# EAGLE design 19260^0 (EAGLE 7.6.0)
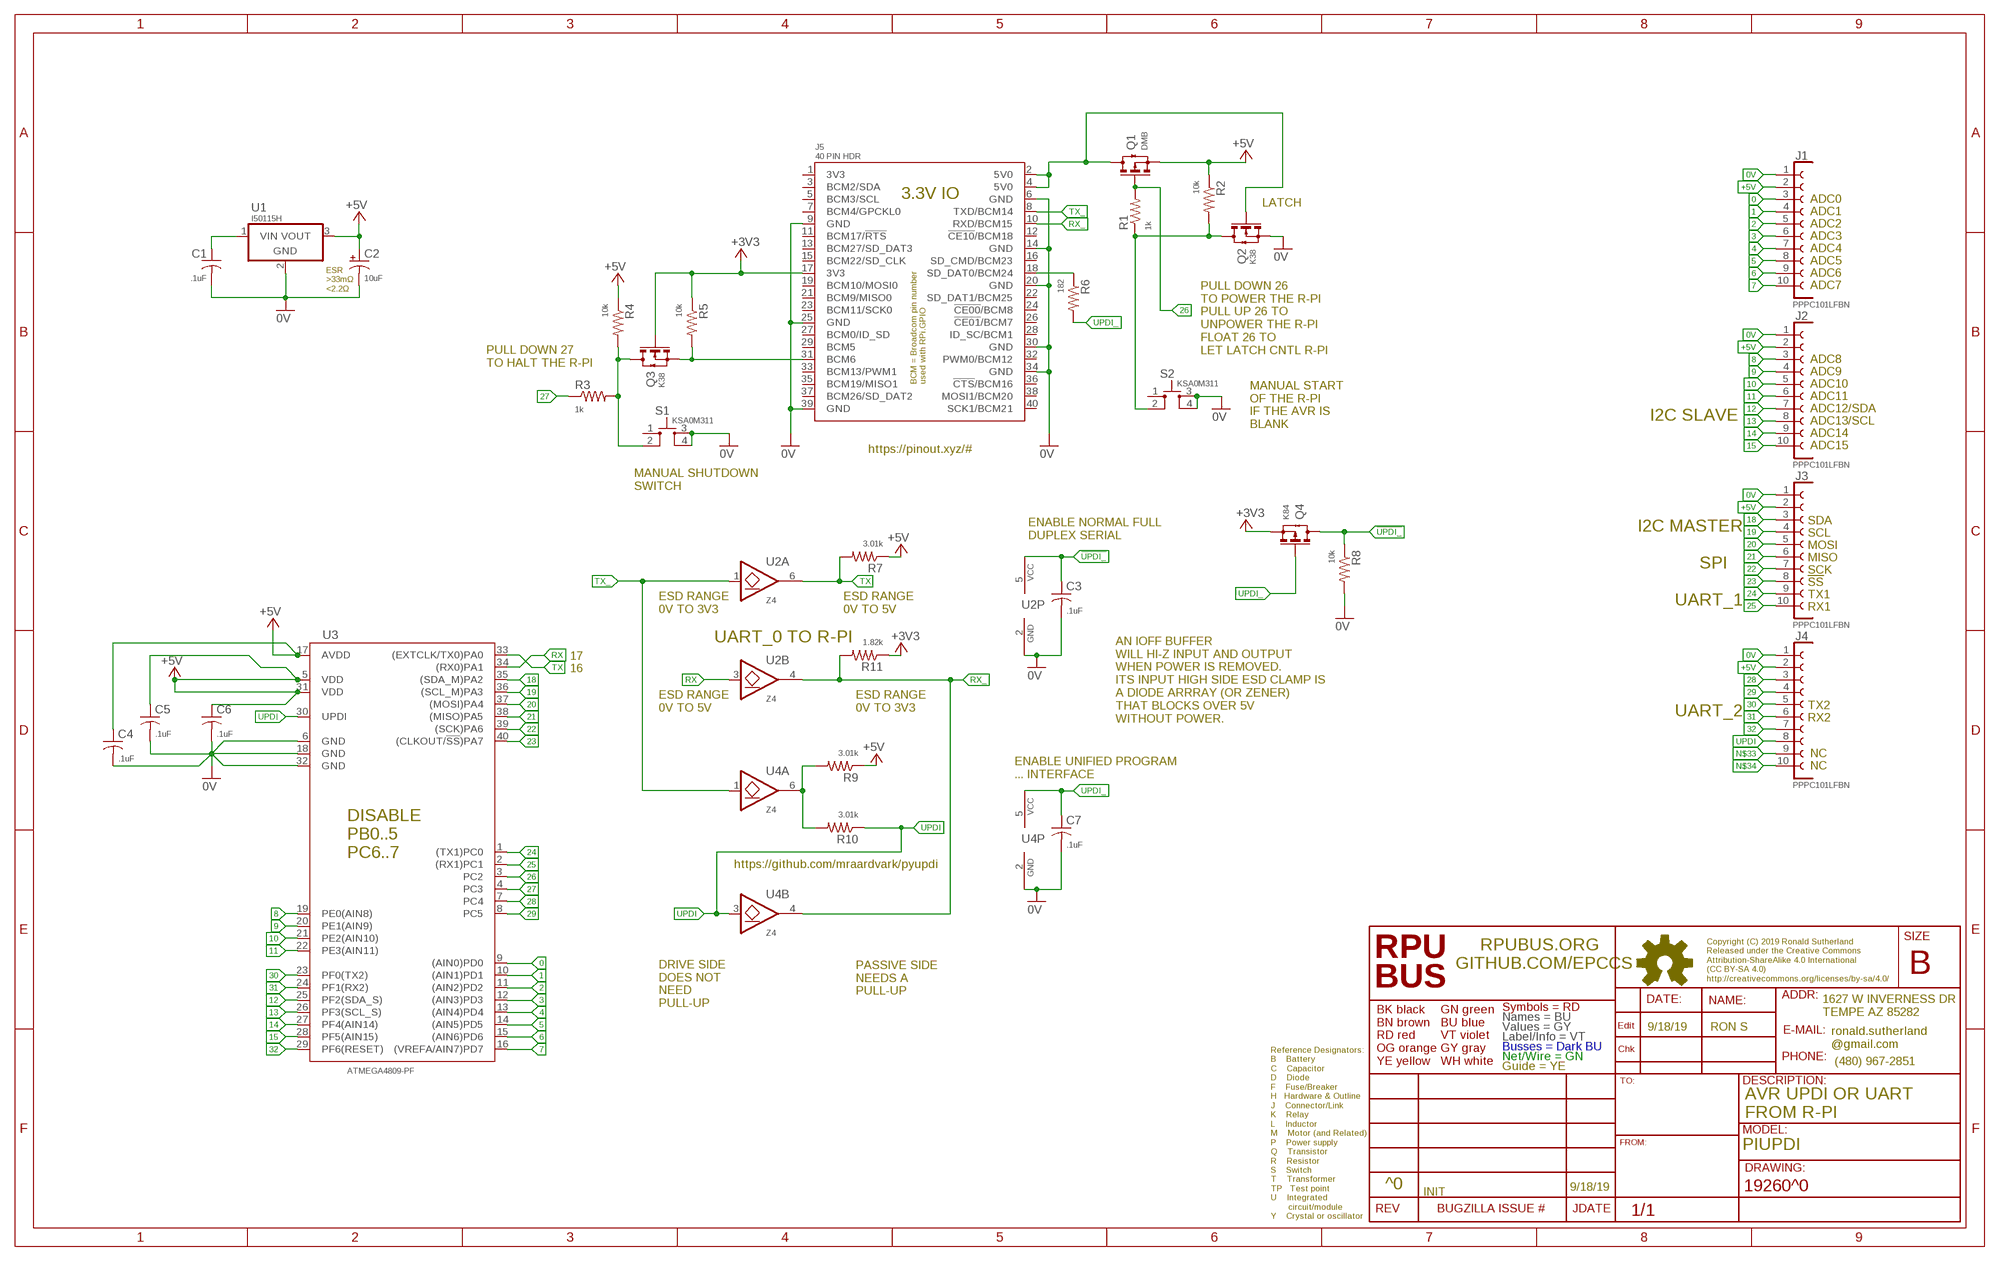
[diagram p0: schematic, sheet 1]

## Parts
C1  .1uF  CC0603A  [C0603(1608)]
C2  10uF  CT1206  [3216]
C3  .1uF  CC0603A  [C0603(1608)]
C4  .1uF  CC0603A  [C0603(1608)]
C5  .1uF  CC0603A  [C0603(1608)]
C6  .1uF  CC0603A  [C0603(1608)]
C7  .1uF  CC0603A  [C0603(1608)]
J1  PPPC101LFBN  F1X10  [F1X10]
J2  PPPC101LFBN  F1X10  [F1X10]
J3  PPPC101LFBN  F1X10  [F1X10]
J4  PPPC101LFBN  F1X10  [F1X10]
J5  40 PIN HDR  RPI-ZERO  [RASPI_ZERO_H40PIN]
Q1  DMB  N-CHSOT23  [SOT23]
Q2  K38  N-CHSOT23  [SOT23]
Q3  K38  N-CHSOT23  [SOT23]
Q4  K84  N-CHSOT23  [SOT23]
R1  1k  R0805  [C0805(2012)]
R2  10k  R0805  [C0805(2012)]
R3  1k  R0805  [C0805(2012)]
R4  10k  R0805  [C0805(2012)]
R5  10k  R0805  [C0805(2012)]
R6  182  R0805  [C0805(2012)]
R7  3.01k  R0805  [C0805(2012)]
R8  10k  R0805  [C0805(2012)]
R9  3.01k  R0805  [C0805(2012)]
R10  3.01k  R0805  [C0805(2012)]
R11  1.82k  R0805  [C0805(2012)]
S1  KSA0M311  [0M311]
S2  KSA0M311  [0M311]
U1  I50115H  OKI-78SR-H  [OKI-78SR-H]
U2  Z4  2G07SOT26  [SOT23-6,SOT26]
U3  ATMEGA4809-PF  ATMEGA4809-PFDIL40  [DIL40]
U4  Z4  2G07SOT26  [SOT23-6,SOT26]

## Nets
0: J1.3 U3.9((AIN0)PD0)
0V: C1.2 C2.- C3.2 C4.2 C5.2 C6.2 C7.2 J1.1 J2.1 J3.1 J4.1 J5.6(GND) J5.9(GND) J5.14(GND) J5.20(GND) J5.25(GND) J5.30(GND) J5.34(GND) J5.39(GND) Q2.2(S)(S) R8.2 S1.3 S1.4 S2.3 S2.4 U1.2(GND) U2.2(P:GND) U3.6(GND) U3.18(GND) U3.32(GND) U4.2(P:GND)
1: J1.4 U3.10((AIN1)PD1)
2: J1.5 U3.11((AIN2)PD2)
3: J1.6 U3.12((AIN3)PD3)
4: J1.7 U3.13((AIN4)PD4)
5: J1.8 U3.14((AIN5)PD5)
5V0@2: J5.2(5V0) J5.4(5V0) Q1.3(D)(D) Q2.1(G)(G)
6: J1.9 U3.15((AIN6)PD6)
7: J1.10 U3.16((VREFA/AIN7)PD7)
8: J2.3 U3.19(PE0(AIN8))
9: J2.4 U3.20(PE1(AIN9))
10: J2.5 U3.21(PE2(AIN10))
11: J2.6 U3.22(PE3(AIN11))
12: J2.7 U3.25(PF2(SDA_S))
13: J2.8 U3.26(PF3(SCL_S))
14: J2.9 U3.27(PF4(AIN14))
15: J2.10 U3.28(PF5(AIN15))
18: J3.3 U3.35((SDA_M)PA2)
19: J3.4 U3.36((SCL_M)PA3)
20: J3.5 U3.37((MOSI)PA4)
21: J3.6 U3.38((MISO)PA5)
22: J3.7 U3.39((SCK)PA6)
23: J3.8 U3.40((CLKOUT/!SS!)PA7)
24: J3.9 U3.1((TX1)PC0)
25: J3.10 U3.2((RX1)PC1)
26: Q1.1(G)(G) R1.2 U3.3(PC2)
27: R3.1 U3.4(PC3)
28: J4.3 U3.7(PC4)
29: J4.4 U3.8(PC5)
30: J4.5 U3.23(PF0(TX2))
31: J4.6 U3.24(PF1(RX2))
32: J4.7 U3.29(PF6(RESET))
!UPDI_: C3.1 Q4.3(D)(D) R8.1 U2.5(P:VCC)
+3V3: J5.17(3V3) Q3.1(G)(G) Q4.2(S)(S) R5.1 R11.1
+5V: C2.+ C4.1 C5.1 C6.1 J1.2 J2.2 J3.2 J4.2 Q1.2(S)(S) R2.1 R4.1 R7.1 R9.1 U1.3(VOUT) U3.5(VDD) U3.17(AVDD) U3.31(VDD)
N$2: J5.18(SD_DAT0/BCM24) R6.1
N$3: Q3.3(D)(D) R3.2 R4.2 S1.2
N$4: R9.2 R10.2 U4.6(A:O)
N$6: Q2.3(D)(D) R1.1 R2.2 S2.2
N$33: J4.9
N$34: J4.10
RX: U2.3(B:I) U3.34((RX0)PA1)
RX_: J5.10(RXD/BCM15) R11.2 U2.4(B:O) U4.4(B:O)
SHUTDOWN: J5.31(BCM6) Q3.2(S)(S) R5.2
TX: R7.2 U2.6(A:O) U3.33((EXTCLK/TX0)PA0)
TX_: J5.8(TXD/BCM14) U2.1(A:I) U4.1(A:I)
UPDI: J4.8 R10.1 U3.30(UPDI) U4.3(B:I)
UPDI_: C7.1 Q4.1(G)(G) R6.2 U4.5(P:VCC)
VIN: C1.1 U1.1(VIN)
Unconnected: J5.1(3V3) J5.3(BCM2/SDA) J5.5(BCM3/SCL) J5.7(BCM4/GPCKL0) J5.11(BCM17/!RTS!) J5.12(!CE10!/BCM18) J5.13(BCM27/SD_DAT3) J5.15(BCM22/SD_CLK) J5.16(SD_CMD/BCM23) J5.19(BCM10/MOSI0) J5.21(BCM9/MISO0) J5.22(SD_DAT1/BCM25) J5.23(BCM11/SCK0) J5.24(!CE00!/BCM8) J5.26(!CE01!/BCM7) J5.27(BCM0/ID_SD) J5.28(ID_SC/BCM1) J5.29(BCM5) J5.32(PWM0/BCM12) J5.33(BCM13/PWM1) J5.35(BCM19/MISO1) J5.36(!CTS!/BCM16) J5.37(BCM26/SD_DAT2) J5.38(MOSI1/BCM20) J5.40(SCK1/BCM21) S1.1 S2.1

## Notes on the sheet
- ADC0
- LATCH
- ADC1
- ADC2
- ADC3
- ADC4
- ADC5
- ADC6
- ADC7
- ESR
  >33mΩ
  <2.2Ω
- PULL DOWN 26 
  TO POWER THE R-PI
  PULL UP 26 TO 
  UNPOWER THE R-PI
  FLOAT 26 TO
  LET LATCH CNTL R-PI
- ADC8
- PULL DOWN 27
  TO HALT THE R-PI
- ADC9
- ADC10
- ADC11
- ADC12/SDA
- I2C SLAVE
- ADC13/SCL
- MANUAL START
  OF THE R-PI
  IF THE AVR IS 
  BLANK
- ADC14
- ADC15
- https://pinout.xyz/#
- MANUAL SHUTDOWN
  SWITCH
- SDA
- I2C MASTER
- SCL
- ENABLE NORMAL FULL
  DUPLEX SERIAL
- MOSI
- MISO
- SPI
- SCK
- !SS
- TX1
- UART_1
- RX1
- ESD RANGE
  0V TO 3V3
- ESD RANGE
  0V TO 5V
- UART_0 TO R-PI
- 17
- 16
- TX2
- ESD RANGE
  0V TO 5V
- ESD RANGE
  0V TO 3V3
- UART_2
- RX2
- AN IOFF BUFFER
  WILL HI-Z INPUT AND OUTPUT
  WHEN POWER IS REMOVED.
  ITS INPUT HIGH SIDE ESD CLAMP IS 
  A DIODE ARRRAY (OR ZENER) 
  THAT BLOCKS OVER 5V
  WITHOUT POWER.
- NC
- NC
- ENABLE UNIFIED PROGRAM 
  ... INTERFACE
- https://github.com/mraardvark/pyupdi
- PASSIVE SIDE
  NEEDS A
  PULL-UP
- DRIVE SIDE
  DOES NOT
  NEED 
  PULL-UP
- 9/18/19 | RON S
- AVR UPDI OR UART
  FROM R-PI
- PIUPDI
- ^0 | 9/18/19
- INIT

## Library data of the parts
C1 C3-C7 = C-C:C: CAPACITOR Symbol
C2 = C-T:CT: Tantalum Electrolytic Capacitor
J1-J4 = J-HDR2.54mm:F1X10: FEMALE HEADER 10POS
J5 = U-Pi:RPI-ZERO: Raspberry Pi Zero https://pinout.xyz/ NOTE: WiFi is needed see https://www.kickstarter.com/projects/1991736672/iot-hat-for-raspberry-pi-a-must-have-for-pi-zero
Q1 Q4 = Q-PCH:N-CH?*: ENHANCEMENT MODE MOSFET SOT23 is BSS138 pinout
Q2 Q3 = Q-NCH:N-CH?*: ENHANCEMENT MODE MOSFET SOT23 is BSS138 pinout
R1-R11 = R-C:R: Resiistor American-style symbol
S1 S2 = S-Tactile:KSA: KSA0M311 [C&K,KSA0M311LFT] SWITCH TACTILE SEALED SPST-NO 50MA 32V
U1 = P-DCDC:OKI-78SR: OKI-78SR OKI-78SR-5/1.5-W36H-C 5V@1.5A Horizontal Mount OKI-78SR-5/1.5-W36-C 5V@1.5A Vert Mount OKI-78SR-3.3/1.5-W36H-C 3.3V@1.5A Horizontal Mount OKI-78SR-3.3/1.5-W36-C 3.3V@1.5A Vert Mount Murata Power Solutions 7 to 36 VDC input range need to verify pinout
U2 U4 = U-7400:2G07: BUFFER OPEN DRAIN Z4 [DIODES,74LVC2G07W6-7] LOGIC BUFFER OPEN DRAIN SOT26
U3 = U-AVR:ATMEGA4809-PF: ATMEGA4809-PF 20MHZ 48KB PDIP48 IND 125C GREEN

## Net classes
0 default: width 0.178 mm, drill 0.33 mm

## Board
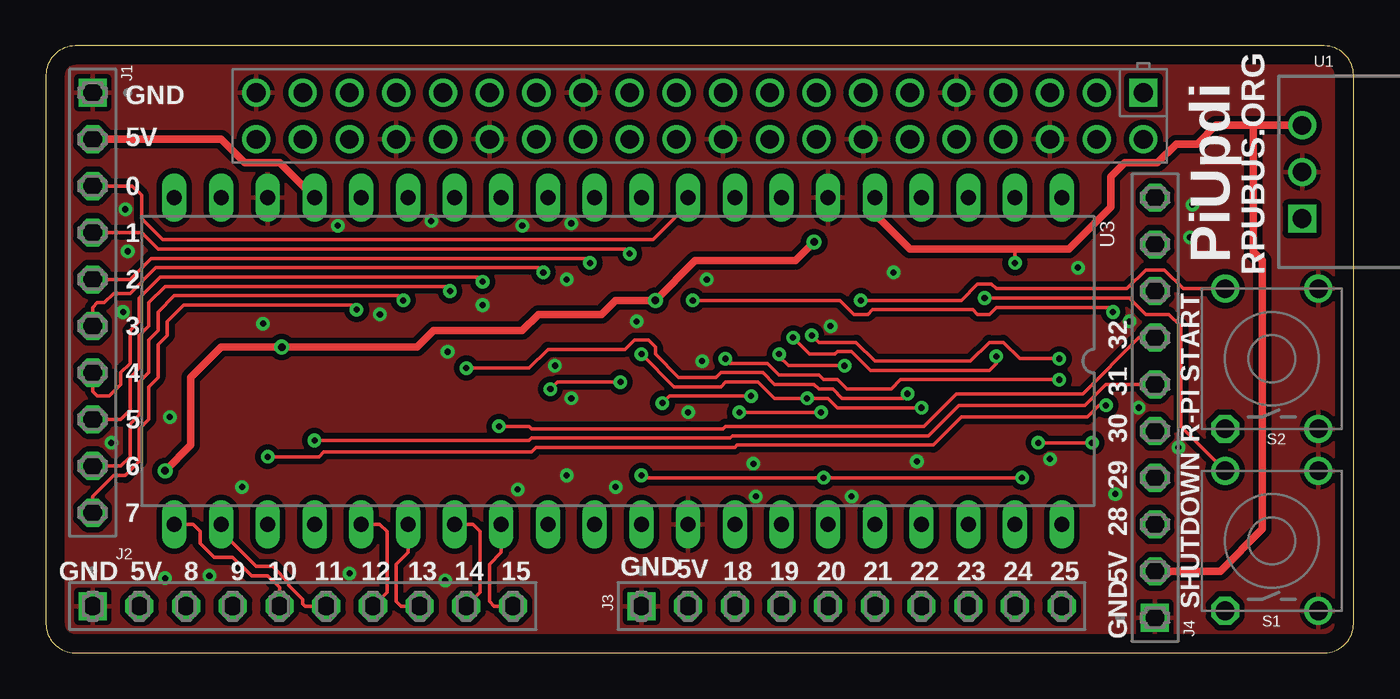
[diagram p1: board, top side]
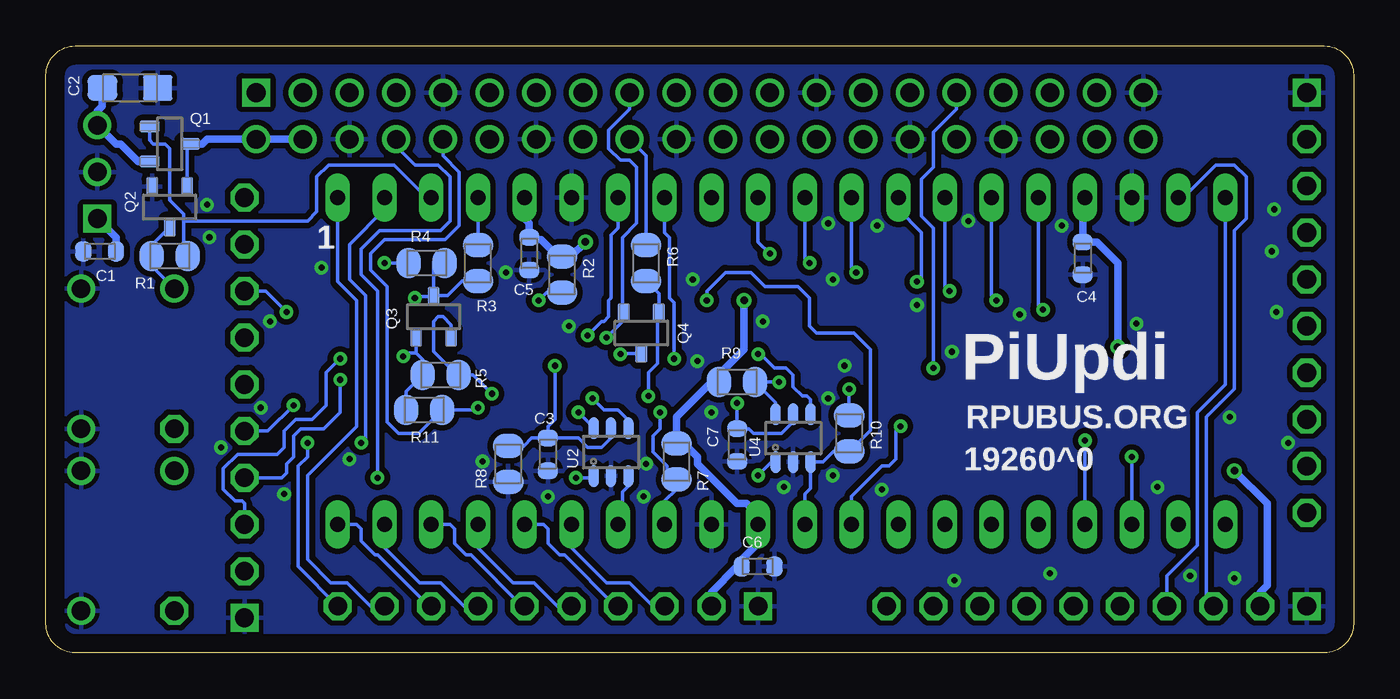
[diagram p2: board, bottom side, seen from below]

Size 71.12 x 33.02 mm. Coordinates in mm from the lower left corner, seen from the top.
Outline: 0,31.43 0,1.59 arc90 1.59,0 69.53,0 arc90 71.12,1.59 71.12,31.43 arc90 69.53,33.02 1.59,33.02 arc90 0,31.43
Copper layers (1*16): Top 0.034290625mm / dielectric 60mil / Bottom 0.034290625mm
Design rules "default *": minimum track width 8mil, minimum drill 13mil, track to track 8mil, track to pad 8mil, pad to pad 7mil, via to via 8mil, smd to smd 7mil, copper to edge 40mil, drill to drill 12mil, minimum pad ring 10mil, minimum via ring 8mil, stop-mask expansion 4mil, vias tented up to drill 17mil, thermal gap 10mil

### Footprints (pad centres in the part's own frame; a part is rotated, then mirrored left to right if it is on the bottom)
C0603(1608) = smd 0.898 x 1.1: 1 -0.889,0; 2 0.889,0
3216 = smd 1.6 x 1.4: + -1.5,0; - 1.5,0
F1X10 = drill 1.016 square: 1 0,0 | drill 1.016 octagon: 2 2.54,0; 3 5.08,0; 4 7.62,0; 5 10.16,0; 6 12.7,0; 7 15.24,0; 8 17.78,0; 9 20.32,0; 10 22.86,0
RASPI_ZERO_H40PIN = drill 1.016 square: 1 0,0 | drill 1.016: 2 0,2.54; 3 2.54,0; 4 2.54,2.54; 5 5.08,0; 6 5.08,2.54; 7 7.62,0; 8 7.62,2.54; 9 10.16,0; 10 10.16,2.54; 11 12.7,0; 12 12.7,2.54; 13 15.24,0; 14 15.24,2.54; 15 17.78,0; 16 17.78,2.54; 17 20.32,0; 18 20.32,2.54; 19 22.86,0; 20 22.86,2.54; 21 25.4,0; 22 25.4,2.54; 23 27.94,0; 24 27.94,2.54; 25 30.48,0; 26 30.48,2.54; 27 33.02,0; 28 33.02,2.54; 29 35.56,0; 30 35.56,2.54; 31 38.1,0; 32 38.1,2.54; 33 40.64,0; 34 40.64,2.54; 35 43.18,0; 36 43.18,2.54; 37 45.72,0; 38 45.72,2.54; 39 48.26,0; 40 48.26,2.54
SOT23 = smd 0.65 x 1.06: 1(G) -0.95,-1.1; 2(S) 0.95,-1.1; 3(D) 0,1.1
C0805(2012) = smd 1.321 x 1.651: 1 -0.977,0; 2 0.977,0
0M311 = drill 1.016 octagon: 1 -3.81,2.54 | drill 1.016: 2 3.81,2.54; 3 -3.81,-2.54; 4 3.81,-2.54
OKI-78SR-H = drill 1.016 square: 1 0,0 | drill 1.016: 2 -2.54,0; 3 -5.08,0
SOT23-6,SOT26 = smd 0.55 x 1.2: 1 -0.95,-1.3; 2 0,-1.3; 3 0.95,-1.3; 4 0.95,1.3; 5 0,1.3; 6 -0.95,1.3
DIL40 = drill 0.813 long: 1 0,0; 2 2.54,0; 3 5.08,0; 4 7.62,0; 5 10.16,0; 6 12.7,0; 7 15.24,0; 8 17.78,0; 9 20.32,0; 10 22.86,0; 11 25.4,0; 12 27.94,0; 13 30.48,0; 14 33.02,0; 15 35.56,0; 16 38.1,0; 17 40.64,0; 18 43.18,0; 19 45.72,0; 20 48.26,0; 21 48.26,17.78; 22 45.72,17.78; 23 43.18,17.78; 24 40.64,17.78; 25 38.1,17.78; 26 35.56,17.78; 27 33.02,17.78; 28 30.48,17.78; 29 27.94,17.78; 30 25.4,17.78; 31 22.86,17.78; 32 20.32,17.78; 33 17.78,17.78; 34 15.24,17.78; 35 12.7,17.78; 36 10.16,17.78; 37 7.62,17.78; 38 5.08,17.78; 39 2.54,17.78; 40 0,17.78

### Placement (x,y rotation side)
C1  68.2,21.84 180 bottom
C2  66.55,30.73 0 bottom
C3  43.81,10.79 270 bottom
C4  14.73,21.46 270 bottom
C5  44.83,21.72 270 bottom
C6  32.38,4.7 0 bottom
C7  33.53,11.3 270 bottom
J1  2.54,30.48 270 top
J2  2.54,2.54 0 top
J3  32.38,2.54 0 top
J4  60.33,1.91 90 top
J5  59.69,30.48 180 top
Q1  64.39,27.69 270 bottom
Q2  64.39,24.26 180 bottom
Q3  50.04,18.29 0 bottom
Q4  38.73,17.4 180 bottom
R1  64.39,21.59 0 bottom
R2  43.05,20.57 270 bottom
R3  47.62,21.21 270 bottom
R4  50.42,21.21 0 bottom
R5  49.66,15.11 0 bottom
R6  38.48,21.21 270 bottom
R7  36.83,10.41 270 bottom
R8  45.97,10.29 270 bottom
R9  33.53,14.73 0 bottom
R10  27.43,11.94 90 bottom
R11  50.55,13.21 0 bottom
S1  66.67,6.1 90 top
S2  66.67,16 90 top
U1  68.33,23.62 270 top
U2  40.39,10.92 0 bottom
U3  55.24,24.77 180 top
U4  30.48,11.68 0 bottom

### Tracks (layer width: path | path; a pad name or v marks a point on that pad's centre or on a via)
0
  Top 0.203: U3.9 34.92,24.38 33.02,22.48 6.35,22.48 5.21,23.62 5.21,24.89 4.7,25.4 J1.3
0V  (via drill 0.33)
  other vias: 20.95,23.5 15.88,23.24 25.91,23.24 28.57,23.37 28.32,20.32 23.75,18.92 18.16,18.41 11.81,17.91 4.32,24.13 4.45,21.84 4.19,18.54 3.56,11.43 6.48,4.06 10.67,9.02 8.89,4.19 16.51,4.32 21.72,3.94 25.65,8.89 28.32,9.65 28.57,13.84 30.99,9.02 38.61,8.51 35.69,15.88 42.67,17.78 43.81,8.51 47.37,10.41 38.48,10.29 54.61,10.54 58.17,8.64 61.59,11.18 59.44,13.34 58.93,18.03 56.13,20.95 62.23,22.61 62.36,24.38 46.1,20.7 6.73,12.83 34.92,13.08 32.13,18.03 21.84,16.38 35.94,20.32 27.69,15.62
  pour Top (isolate 0.305): 71.12,0 0,0 0,33.02 71.12,33.02
  pour Bottom (isolate 0.305): 0,33.02 71.12,33.02 71.12,0 0,0
1  (via drill 0.33)
  Top 0.203: v31.75,21.72 31.5,21.97 6.1,21.97 5.21,22.86 J1.4
  Bottom 0.203: U3.10 32.38,22.35 v31.75,21.72
2  (via drill 0.33)
  Top 0.203: v29.59,21.21 29.34,21.46 5.71,21.46 4.57,20.32 J1.5
  Bottom 0.203: U3.11 29.84,21.46 v29.59,21.21
3  (via drill 0.33)
  Top 0.203: v27.05,20.7 26.8,20.95 5.97,20.95 4.57,19.56 3.68,19.56 3.17,19.05 2.79,19.05 2.54,18.8 J1.6
  Bottom 0.203: U3.12 27.3,20.95 v27.05,20.7
4  (via drill 0.33)
  Top 0.203: v23.75,20.19 23.5,20.45 6.22,20.45 5.08,19.3 5.08,18.03 4.57,17.53 4.57,15.75 4.06,15.24 4.06,14.61 3.43,13.97 2.79,13.97 2.54,14.22 J1.7
  Bottom 0.203: U3.13 24.77,24.13 23.5,22.86 23.5,20.45 v23.75,20.19
5  (via drill 0.33)
  Top 0.203: v21.97,19.68 21.72,19.94 6.48,19.94 5.59,19.05 5.59,17.78 5.08,17.27 5.08,15.49 4.57,14.99 4.57,13.21 4.06,12.7 J1.8
  Bottom 0.203: U3.14 22.23,19.94 v21.97,19.68
5V0@2
  Bottom 0.203: Q2.1(G) 63.44,27.54 Q1.3(D)
  Bottom 0.406: Q1.3(D) 62.61,27.69 62.36,27.94 J5.2 J5.4
6  (via drill 0.33)
  Top 0.203: v19.43,19.18 19.18,19.43 6.99,19.43 6.1,18.54 6.1,17.53 5.59,17.02 5.59,15.24 5.08,14.73 5.08,12.95 4.57,12.45 4.57,10.67 4.06,10.16 J1.9
  Bottom 0.203: U3.15 19.68,19.43 v19.43,19.18
7  (via drill 0.33)
  Top 0.203: v16.89,18.67 16.64,18.92 7.49,18.92 6.6,18.03 6.6,17.27 6.1,16.76 6.1,14.99 5.59,14.48 5.59,12.7 5.08,12.19 5.08,10.41 4.32,9.65 3.68,9.65 2.54,8.51 J1.10
  Bottom 0.203: U3.16 17.14,18.92 v16.89,18.67
8
  Bottom 0.203: U3.19 9.27,24.77 7.49,26.54 6.48,26.54 5.84,25.91 5.84,23.62 6.48,22.99 6.48,14.35 8,12.83 8,2.92 J2.3
9
  Bottom 0.203: U3.20 6.99,14.61 8.51,13.08 8.51,5.84 10.16,4.19 J2.4
10
  Top 0.203: U3.21 8,6.99 8.38,6.6 8.38,5.97 9.14,5.21 10.16,5.21 11.18,4.19 12.06,4.19 12.7,3.56 J2.5
11
  Top 0.203: U3.22 9.53,6.6 11.43,4.7 12.32,4.7 13.21,3.81 13.21,3.68 13.97,2.92 13.97,2.67 14.1,2.54 J2.6
12
  Top 0.203: J2.7 18.54,3.3 18.54,6.6 18.16,6.99 U3.25
13
  Top 0.203: J2.8 19.3,2.54 19.05,2.79 19.05,4.83 19.68,5.46 U3.26
14
  Top 0.203: J2.9 23.62,3.3 23.62,6.6 23.24,6.99 U3.27
15
  Top 0.203: J2.10 24.38,2.54 24.13,2.79 24.13,4.83 24.77,5.46 U3.28
18
  Bottom 0.203: J3.3 38.1,2.54 39.37,3.81 40.64,3.81 42.55,5.71 U3.35
19
  Bottom 0.203: J3.4 40.13,2.54 42.93,5.33 43.18,5.33 43.81,5.97 43.81,6.73 44.07,6.99 U3.36
20
  Bottom 0.203: J3.5 43.31,2.54 44.58,3.81 45.72,3.81 47.62,5.71 U3.37
21
  Bottom 0.203: J3.6 45.21,2.54 48.01,5.33 48.26,5.33 48.9,5.97 48.9,6.73 49.15,6.99 U3.38
22
  Bottom 0.203: J3.7 48.39,2.54 49.66,3.81 50.8,3.81 52.7,5.71 U3.39
23
  Bottom 0.203: J3.8 50.29,2.54 53.09,5.33 53.21,5.33 53.98,6.1 53.98,6.73 54.23,6.99 U3.40
24
  Bottom 0.203: U3.1 55.24,20.19 54.23,19.18 54.23,12.32 56.9,9.65 56.9,5.08 55.63,3.81 54.74,3.81 53.47,2.54 J3.9
25  (via drill 0.33)
  Top 0.203: v53.98,11.43 v56.9,11.43
  Bottom 0.203: U3.2 52.7,24.13 54.61,22.23 54.61,20.32 53.72,19.43 53.72,11.68 v53.98,11.43 | v56.9,11.43 56.9,10.67 57.4,10.16 57.4,4.7 J3.10
26
  Bottom 0.203: Q1.1(G) 65.49,27.9 65.28,27.69 64.64,27.69 64.39,27.43 64.39,24.64 63.63,23.88 63.63,23.5 | 63.63,23.5 63.63,21.8 R1.2 | U3.3 50.42,24.77 52.2,26.54 55.75,26.54 56.39,25.91 56.39,24 56.9,23.5 63.63,23.5
27
  Bottom 0.203: R3.1 U3.4
28  (via drill 0.33)
  Top 0.203: v41.66,17.27 42.04,16.89 44.07,16.89 45.09,15.88 50.29,15.88 51.31,16.89 52.07,16.89 52.96,16 v55.12,16
  Bottom 0.203: U3.7 40.01,23.11 40.39,22.73 40.39,19.3 40.51,19.18 40.51,18.29 40.77,18.03 40.89,18.03 v41.66,17.27 | v55.12,16 55.88,15.24 55.88,13.46 56.64,12.7 57.53,12.7 58.17,12.06 58.17,11.18 58.55,10.79 60.71,10.79 61.47,10.03 61.47,8.89 60.83,8.26 60.45,8.26 60.33,8.13 J4.3
29  (via drill 0.33)
  Top 0.203: v36.96,16 37.21,15.75 39.24,15.75 39.88,15.11 42.04,15.11 42.29,14.86 43.05,14.86 43.56,14.35 45.97,14.35 46.48,14.86 v55.12,14.86
  Bottom 0.203: U3.8 37.47,22.86 37.21,22.61 37.21,19.3 36.96,19.05 v36.96,16 | v55.12,14.86 55.12,13.08 56.01,12.19 57.28,12.19 57.66,11.81 57.66,10.67 58.04,10.29 58.04,9.78 58.29,9.53 J4.4
30  (via drill 0.33)
  Top 0.203: v57.66,13.46 57.28,13.46 56.64,12.83 49.78,12.83 48.26,11.3 37.59,11.3 37.47,11.18 26.67,11.18 26.42,10.92 15.11,10.92 14.86,10.67 v12.06,10.67
  Bottom 0.203: J4.5 59.05,12.06 v57.66,13.46 | v12.06,10.67 U3.23
31  (via drill 0.33)
  Top 0.203: J4.6 57.66,14.61 56.52,13.46 49.66,13.46 48.01,11.81 37.34,11.81 37.21,11.68 26.42,11.68 26.29,11.56 v14.61,11.56
  Bottom 0.203: v14.61,11.56 U3.24
32  (via drill 0.33)
  Top 0.203: J4.7 59.44,17.14 56.39,14.1 49.53,14.1 47.75,12.32 36.96,12.32 36.83,12.19 26.42,12.19 26.29,12.32 v24.64,12.32
  Bottom 0.203: U3.29 27.3,8.51 25.65,10.16 25.27,10.16 24.89,10.54 24.89,12.06 v24.64,12.32
!UPDI_  (via drill 0.33)
  Top 0.203: v39.88,16.26 39.88,16.13 40.39,15.62 v43.43,15.62
  Bottom 0.203: R8.1 45.12,11.26 44.7,11.68 C3.1 | C3.1 42.16,11.68 41.66,11.18 40.89,11.18 40.39,11.68 U2.5 | Q4.3(D) 39.84,16.3 v39.88,16.26 | v43.43,15.62 43.43,12.7 43.81,12.32 C3.1
+3V3  (via drill 0.33)
  Top 0.203: v40.64,17.14 41.53,16.26 42.93,16.26 43.05,16.38 43.81,16.38 44.83,15.37 51.31,15.37 51.69,15.75 v51.69,16.13
  Bottom 0.203: J5.17 39.37,29.59 40.51,28.45 40.51,27.43 39.88,26.8 39.37,26.8 38.99,26.42 38.99,23.37 39.75,22.61 39.75,18.57 | 39.75,18.57 Q4.2(S) | 39.75,18.57 39.75,18.03 v40.64,17.14 | 50.99,16.32 50.63,15.96 R5.1 51.52,14.22 R11.1 | Q3.1(G) 50.99,16.32 | 50.99,16.32 51.5,16.32 v51.69,16.13
+5V  (via drill 0.33, 0.41)
  Top 0.203: v52.7,21.21 52.7,21.97
  Top 0.406: J1.2 9.53,27.94 10.79,26.67 12.7,26.67 U3.17 | v6.48,9.91 7.87,11.3 7.87,14.99 9.53,16.64 v12.83,16.64 20.19,16.64 21.08,17.53 25.91,17.53 26.8,18.41 30.23,18.41 30.99,19.18 v33.15,19.18 35.31,21.34 40.77,21.34 v41.78,22.35 | U1.3 65.66,28.7 | 65.66,28.7 63.63,28.7 62.61,27.69 61.47,27.69 60.45,26.67 58.67,26.67 57.91,25.91 57.91,24.26 55.63,21.97 52.7,21.97 46.99,21.97 45.09,23.88 U3.5 | J4.2 63.88,4.45 66.17,6.73 66.17,21.34 65.66,21.84 65.66,28.7
  Bottom 0.203: R4.1 v52.7,21.21
  Bottom 0.406: U3.17 14.73,24.64 C4.1 13.97,22.35 12.83,21.21 v12.83,16.64 | J2.2 5.08,3.3 4.7,3.68 4.7,8.13 v6.48,9.91 | R9.1 34.63,14.39 | J3.2 34.92,3.3 33.53,4.7 C6.1 33.27,5.08 32.38,5.97 U3.31 32.38,7.49 33.02,8.13 33.53,8.13 35.69,10.29 35.69,10.67 36.2,11.18 36.62,11.18 R7.1 36.83,12.83 34.92,14.73 R9.1 | U3.5 45.09,23.62 44.83,23.37 C5.1 44.7,22.48 44.2,22.48 43.27,21.55 R2.1 42.58,21.55 v41.78,22.35 | v33.15,19.18 33.15,16.51 34.54,15.11 34.54,14.82 R9.1 | Q1.2(S) 66.11,26.74 67.06,27.69 67.31,27.69 U1.3 68.33,29.46 68.05,29.74 C2.+
N$2
  Bottom 0.203: R6.1 38.48,27.05 J5.18
N$3  (via drill 0.33)
  Top 0.203: v51.05,19.3 58.93,19.3 59.82,18.41 61.09,18.41 61.72,17.78 61.72,12.32 S1.2
  Bottom 0.203: Q3.3(D) 50.04,21.3 R4.2 | R3.2 48.48,20.23 49.28,19.43 49.99,19.43 Q3.3(D) | Q3.3(D) 50.97,19.39 v51.05,19.3
N$4  (via drill 0.33)
  Top 0.203: v27.43,14.35 27.81,14.73 v31.24,14.73
  Bottom 0.203: U4.6 31.43,13.61 R9.2 v31.24,14.73 | R10.2 v27.43,14.35
N$6  (via drill 0.33)
  Top 0.203: v44.32,19.18 49.78,19.18 50.67,20.07 51.44,20.07 51.69,19.81 58.8,19.81 59.82,20.83 60.83,20.83 61.85,19.81 S2.2
  Bottom 0.203: R2.2 43.9,19.6 v44.32,19.18 | S2.2 65.37,21.04 R1.1 65.37,22.18 Q2.3(D)
RX
  Bottom 0.203: U2.3 39.44,9.08 39.75,8.76 39.75,8 40.01,7.75 U3.34
RX_  (via drill 0.33)
  Top 0.203: v47.62,13.34 43.05,13.34 42.55,13.84 v41.4,13.84 39.62,13.84 38.73,14.73 36.96,14.73 36.7,14.48 34.16,14.48 v32.38,16.26
  Bottom 0.203: v47.62,13.34 47.75,13.21 R11.2 50.84,11.94 51.94,11.94 52.58,12.57 52.58,19.94 53.47,20.83 53.47,21.72 52.7,22.48 49.4,22.48 48.64,23.24 48.64,26.16 49.53,27.05 J5.10 | v32.38,16.26 32.26,16.26 31.5,15.49 30.86,15.49 30.48,15.11 30.48,14.48 29.97,13.97 29.72,13.97 29.53,13.78 U4.4 | U2.4 39.44,12.64 40.01,13.21 40.77,13.21 v41.4,13.84
SHUTDOWN  (via drill 0.33)
  Top 0.203: v22.86,15.49 26.29,15.49 27.3,16.51 31.5,16.51 32,17.02 32.77,17.02 33.15,16.64 33.15,16.26 34.42,14.99 36.45,14.99 36.7,15.24 38.99,15.24 39.62,14.61 41.78,14.61 42.04,14.35 42.8,14.35 43.31,13.84 46.61,13.84 v46.86,14.1
  Bottom 0.203: J5.31 21.59,29.59 22.86,28.32 22.86,26.42 23.5,25.78 23.5,23.75 22.86,23.11 v22.86,15.49 | v46.86,14.1 47.88,15.11 R5.2 49.09,15.52 49.18,15.52 50.04,16.38 50.04,18.03 49.78,18.29 49.53,18.29 49.09,17.85 Q3.2(S)
TX  (via drill 0.33)
  Top 0.203: v42.16,13.08 v37.72,13.08
  Bottom 0.203: U3.33 37.47,8.26 36.83,8.89 R7.2 37.34,9.95 37.34,10.16 38.1,10.92 38.1,11.81 37.72,12.19 v37.72,13.08 | U2.6 41.34,12.25 v42.16,13.08
TX_  (via drill 0.33)
  Top 0.203: v32.38,9.65 32.51,9.53 v42.29,9.53 v53.09,9.53
  Bottom 0.203: U4.1 31.65,10.38 v32.38,9.65 | v42.29,9.53 41.43,9.53 U2.1 | J5.8 52.07,27.56 51.05,26.54 49.78,26.54 49.15,25.91 49.15,23.5 49.66,22.99 52.96,22.99 53.98,21.97 53.98,20.57 53.09,19.68 v53.09,9.53
UPDI  (via drill 0.33)
  Top 0.203: v58.04,18.54 57.78,18.8 51.69,18.8 51.31,18.41 50.67,18.41 50.42,18.67 44.96,18.67 44.7,18.41 43.94,18.41 43.18,19.18 v35.18,19.18
  Bottom 0.203: U3.30 29.84,8.64 29.53,8.95 U4.3 28.86,10.38 28.28,10.96 R10.1 26.29,12.1 26.29,16.51 27.18,17.4 29.21,17.4 29.59,17.78 29.59,19.3 30.23,19.94 32,19.94 32.77,20.7 34.16,20.7 35.18,19.68 v35.18,19.18 | J4.8 59.18,19.68 v58.04,18.54
UPDI_  (via drill 0.33)
  Top 0.203: v33.53,13.59 33.91,13.97 v38.35,13.97
  Bottom 0.203: U4.5 30.48,12.57 31.11,11.94 32.64,11.94 32.89,12.19 C7.1 v33.53,13.59 | v38.35,13.97 38.35,15.24 37.85,15.75 37.85,18.44 Q4.1(G) 37.78,19.54 R6.2
VIN
  Bottom 0.406: C1.1 67.31,22.61 U1.1

### Text on the board
tPlace: GND | 5V | 0 | 1 | PiUpdi | RPUBUS.ORG | 2 | 3 | 32 | 4 | 31 | 5 | 30 | R-PI START | 6 | 29 | 7 | 28 | GND | 5V | 8 | 9 | 10 | 11 | 12 | 13 | 14 | 15 | GND | 5V | 18 | 19 | 20 | 21 | 22 | 23 | 24 | 25 | 5V | SHUTDOWN | GND
bPlace: 1 | PiUpdi | RPUBUS.ORG | 19260^0